# EAGLE design PDM (EAGLE 7.7.0)
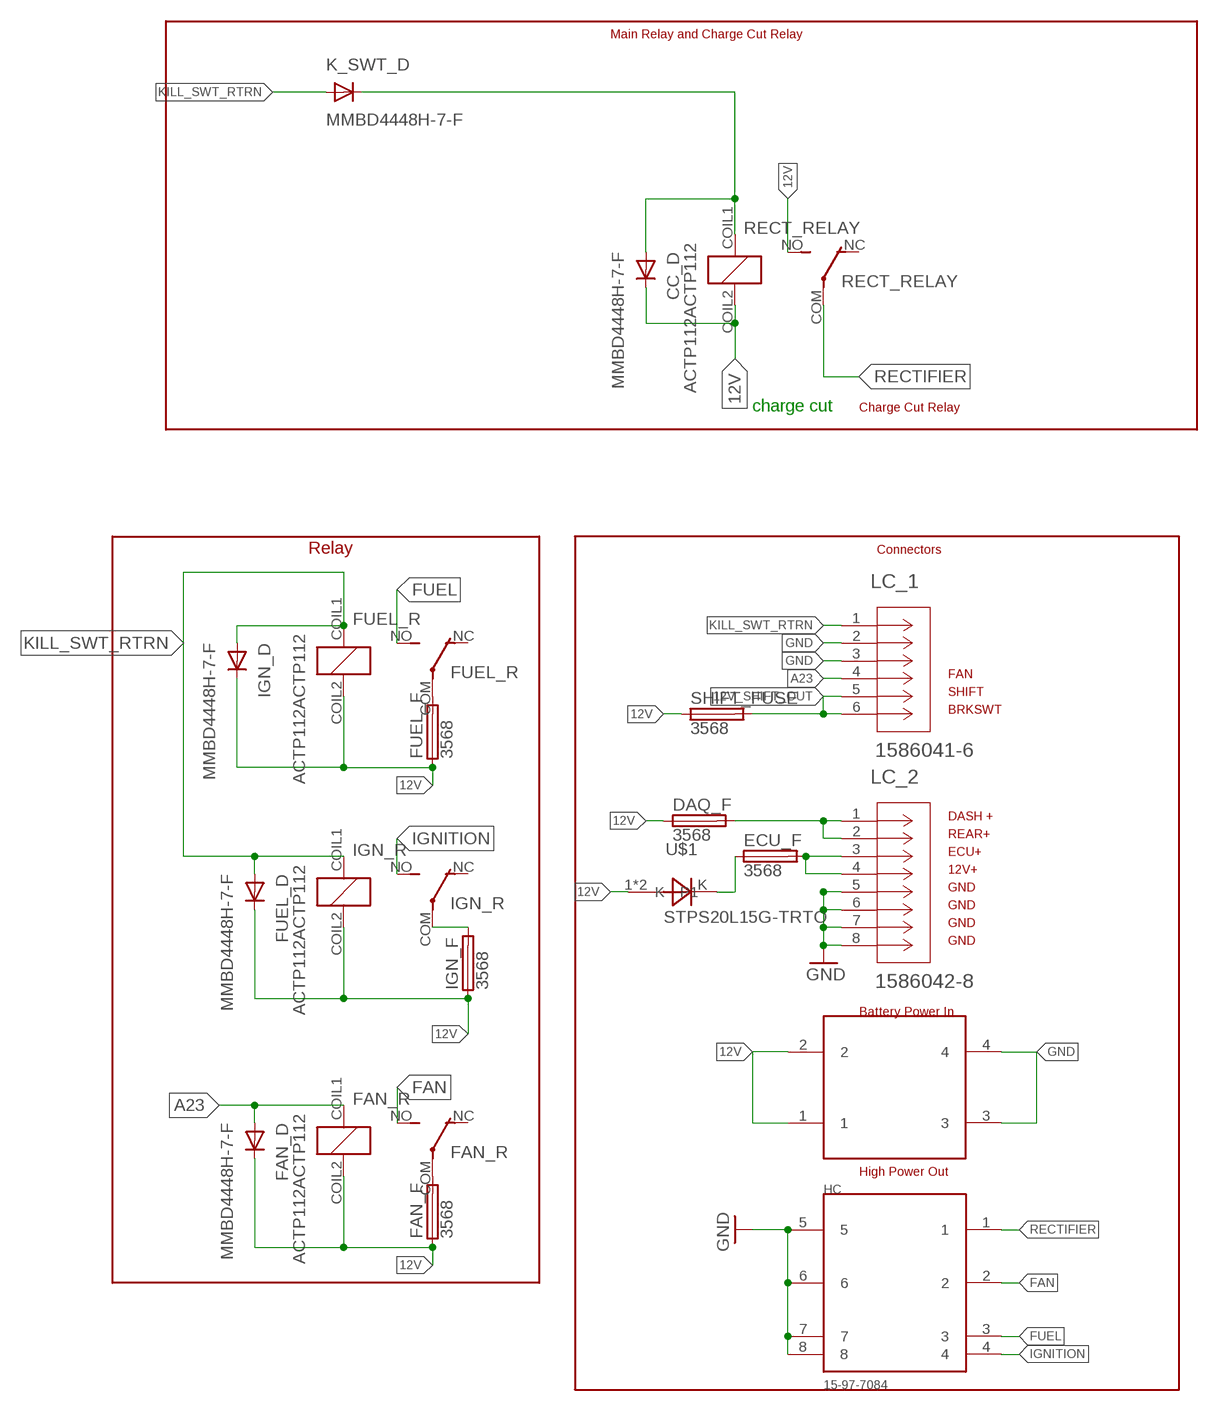
[diagram p0: schematic, sheet 1]

## Parts
BAT_SUP  15-97-8043  [15-97-8043]
CC_D  MMBD4448H-7-F  [SOT23-3]
DAQ_F  3568  [3568]
ECU_F  3568  [3568]
FAN_D  MMBD4448H-7-F  [SOT23-3]
FAN_F  3568  [3568]
FAN_R  ACTP112ACTP112  [ACTP112]
FUEL_D  MMBD4448H-7-F  [SOT23-3]
FUEL_F  3568  [3568]
FUEL_R  ACTP112ACTP112  [ACTP112]
HC  15-97-7084  [15-97-7084]
IGN_D  MMBD4448H-7-F  [SOT23-3]
IGN_F  3568  [3568]
IGN_R  ACTP112ACTP112  [ACTP112]
K_SWT_D  MMBD4448H-7-F  [SOT23-3]
LC_1  1586041-6  [1586041-6]
LC_2  1586042-8  [1586042-8]
RECT_RELAY  ACTP112ACTP112  [ACTP112]
SHIFT_FUSE  3568  [3568]
U$1  STPS20L15G-TRTO  [TO-262DIODE]

## Nets
12V: BAT_SUP.1 BAT_SUP.2 CC_D.3(C) DAQ_F.1 DAQ_F.2 FAN_D.3(C) FAN_F.1 FAN_F.2 FAN_R.COIL2 FUEL_D.3(C) FUEL_F.1 FUEL_F.2 FUEL_R.COIL2 IGN_D.3(C) IGN_F.1 IGN_F.2 IGN_R.COIL2 RECT_RELAY.COIL2 RECT_RELAY.NO SHIFT_FUSE.1 SHIFT_FUSE.2 U$1.1 U$1.2(P1)
12V_DAQ_OUT: DAQ_F.3 DAQ_F.4 LC_2.1 LC_2.2
12V_FUSED_ECU: ECU_F.3 ECU_F.4 LC_2.3 LC_2.4
12V_SHIFT_OUT: LC_1.5 LC_1.6 SHIFT_FUSE.3 SHIFT_FUSE.4
A23: FAN_D.1(A) FAN_R.COIL1 LC_1.4
ECU_PROTECTED: ECU_F.1 ECU_F.2 U$1.K
FAN: FAN_R.NO HC.2
FAN_12V: FAN_F.3 FAN_F.4 FAN_R.COM
FUEL: FUEL_R.NO HC.3
FUEL_12V: FUEL_F.3 FUEL_F.4 FUEL_R.COM
GND: BAT_SUP.3 BAT_SUP.4 HC.5 HC.6 HC.7 HC.8 LC_1.2 LC_1.3 LC_2.5 LC_2.6 LC_2.7 LC_2.8
IGN_12V: IGN_F.3 IGN_F.4 IGN_R.COM
IGNITION: HC.4 IGN_R.NO
KILL_SWITCH_DIODE: CC_D.1(A) K_SWT_D.3(C) RECT_RELAY.COIL1
KILL_SWT_RTRN: FUEL_D.1(A) FUEL_R.COIL1 IGN_D.1(A) IGN_R.COIL1 K_SWT_D.1(A) LC_1.1
RECTIFIER: HC.1 RECT_RELAY.COM
Unconnected: FAN_R.NC FUEL_R.NC IGN_R.NC RECT_RELAY.NC

## Notes on the sheet
- Main Relay and Charge Cut Relay
- charge cut | Charge Cut Relay
- Relay | Connectors
- FAN
- SHIFT
- BRKSWT
- DASH +
- REAR+
- ECU+
- 12V+
- GND
- GND
- GND
- GND
- Battery Power In
- High Power Out

## Library data of the parts
BAT_SUP = molex:15-97-8043
CC_D FAN_D FUEL_D IGN_D K_SWT_D = diodes-inc:MMBD4448H-7-F
DAQ_F ECU_F FAN_F FUEL_F IGN_F SHIFT_FUSE = Keystone:3568: Mini ATC Fuse Holder 20A 500V 1 Circuit Blade PCB
FAN_R FUEL_R IGN_R RECT_RELAY = panasonic:ACTP112: ACTP112 Through-Hole Micro Relay
HC = molex:15-97-7084
LC_1 = BMS Lbr:1586041-6: TE VAL-U-LOK TPA 6 Pin Header
LC_2 = BMS Lbr:1586042-8: 1586042-8 8 pin Val-U-Lock TPA
U$1 = st-microelectronics:STPS20L15G-TR

## Board
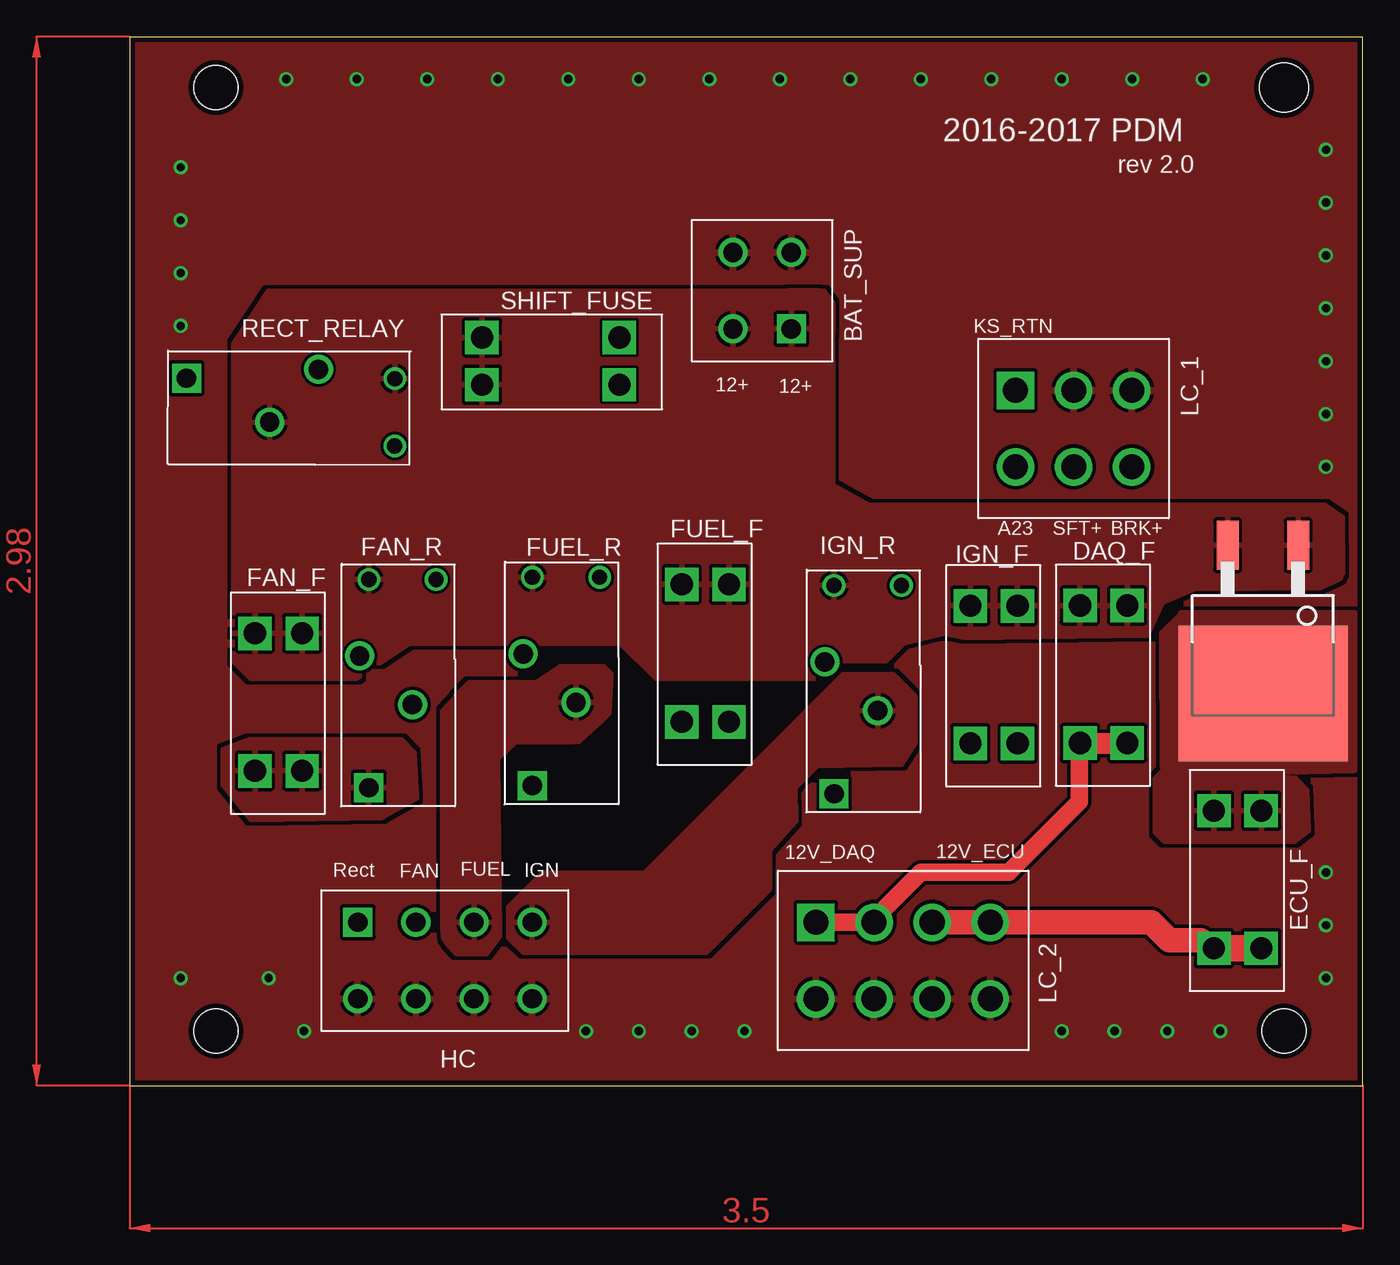
[diagram p1: board, top side]
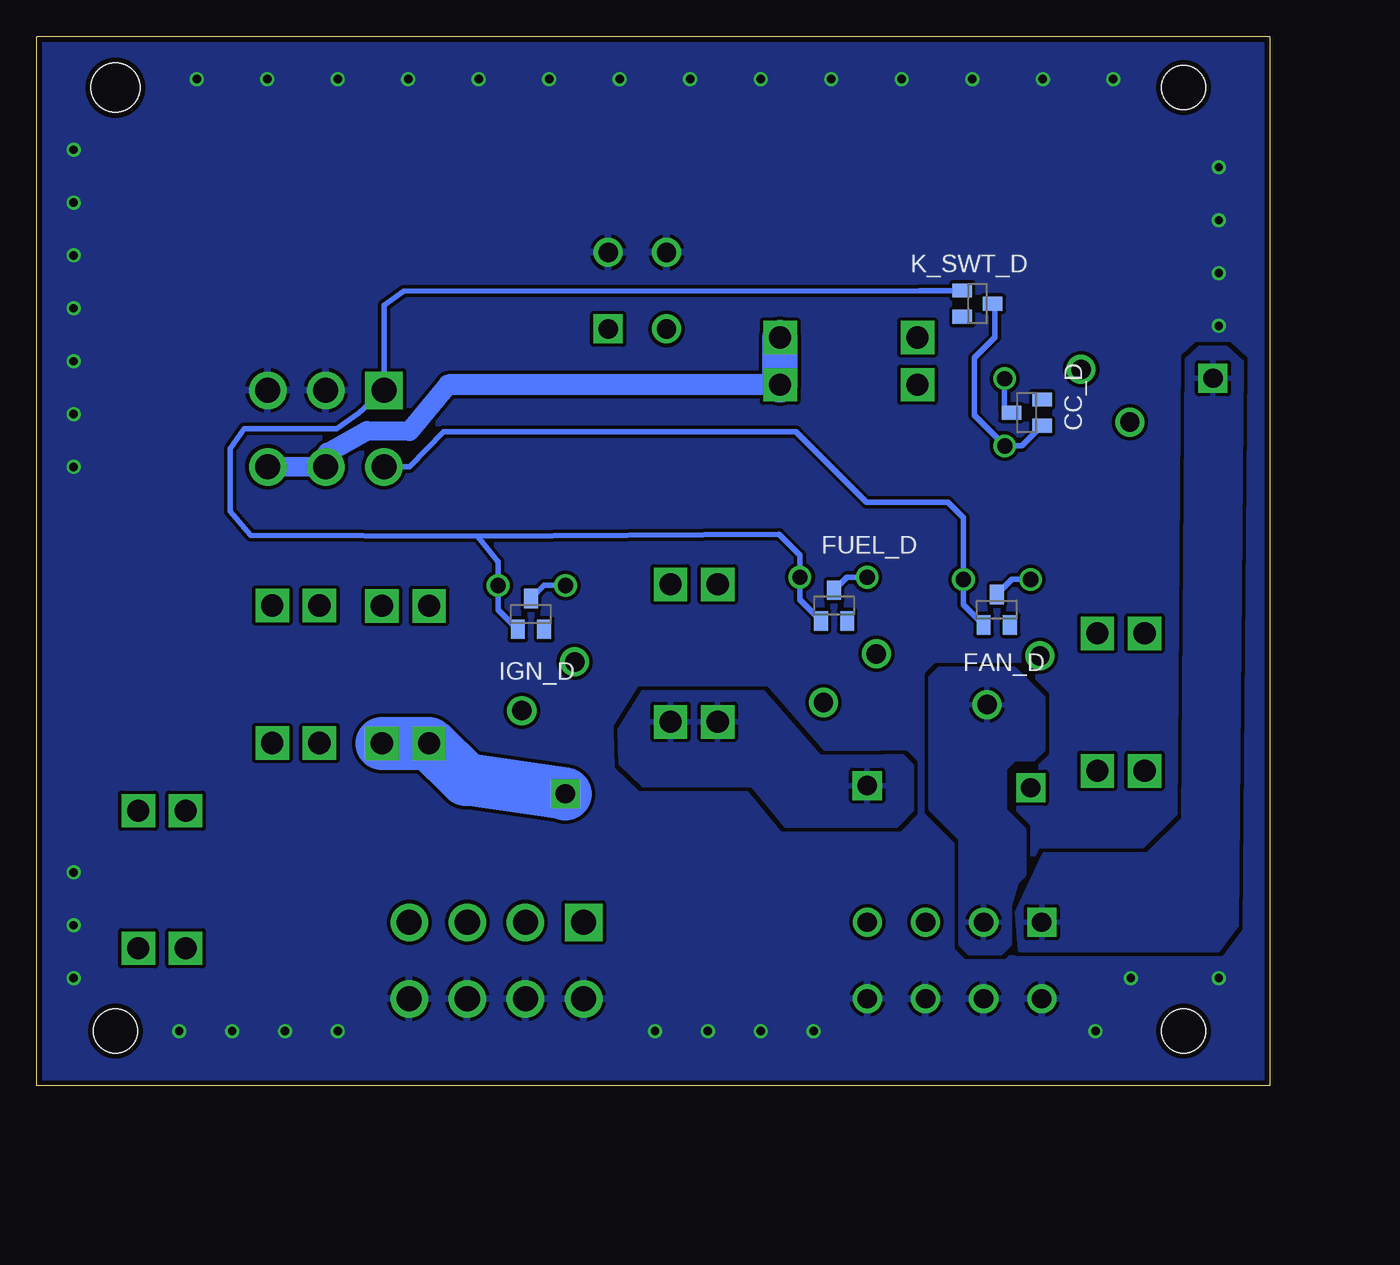
[diagram p2: board, bottom side, seen from below]

Size 88.9 x 75.59 mm. Coordinates in mm from the lower left corner, seen from the top.
Outline: 0,0 88.9,0 88.9,75.59 0,75.59 0,0
Copper layers (1*16): Top 0.035mm / dielectric 1.5mm / Bottom 0.035mm
Design rules "default *": minimum track width 10mil, minimum drill 15mil, track to track 8mil, track to pad 8mil, pad to pad 8mil, via to via 8mil, smd to smd 8mil, copper to edge 15mil, drill to drill 18mil, minimum pad ring 10mil, minimum via ring 8mil, stop-mask expansion 4mil, vias tented up to drill 0mil, thermal gap 10mil
Holes 3.17 mm at 6.22,3.94 83.21,3.94 6.22,71.91
Holes 3.56 mm at 83.21,71.91

### Footprints (pad centres in the part's own frame; a part is rotated, then mirrored left to right if it is on the bottom)
15-97-8043 = drill 1.397 pad 1.803 square: 1 2.101,-2.756 | drill 1.397 pad 1.803: 2 -2.101,-2.756; 4 -2.101,2.756 | drill 1.397 pad 1.829: 3 2.101,2.756
SOT23-3 = smd 1 x 1.4: 1 -0.95,-1.1; 2 0.95,-1.1; 3 0,1.1
3568 = drill 1.6 square: 1 -4.953,1.702; 2 -4.953,-1.702; 3 4.953,1.702; 4 4.953,-1.702
ACTP112 = drill 1.092: COIL1 5.512,-5.512; COIL2 5.512,-0.66 | drill 1.397 square: COM -9.5,-0.66 | drill 1.397: NC 0,0; NO -3.505,-3.81
15-97-7084 = drill 1.397 square: 1 6.287,-2.756 | drill 1.397: 2 2.095,-2.756; 3 -2.095,-2.756; 4 -6.287,-2.756; 5 6.287,2.756; 6 2.095,2.756; 7 -2.095,2.756; 8 -6.287,2.756
1586041-6 = drill 1.803 square: 1 -4.191,2.756 | drill 1.803: 2 0,2.756; 3 4.191,2.756; 4 -4.191,-2.756; 5 0,-2.756; 6 4.191,-2.756
1586042-8 = drill 1.803 square: 1 -6.287,2.756 | drill 1.803: 2 -2.095,2.756; 3 2.095,2.756; 4 6.287,2.756; 5 -6.287,-2.756; 6 -2.095,-2.756; 7 2.095,-2.756; 8 6.287,-2.756
TO-262DIODE = smd 1.6 x 3.5: 1 -2.54,-5.08; 2 2.54,-5.08 | smd 12.2 x 9.75: K 0,5.601

### Placement (x,y rotation side)
BAT_SUP  45.59,57.28 0 top
CC_D  17.53,48.49 90 bottom
DAQ_F  70.21,29.64 270 top
ECU_F  79.86,14.86 270 top
FAN_D  19.68,34.29 0 bottom
FAN_F  10.74,27.64 270 top
FAN_R  16.59,30.96 90 top
FUEL_D  31.42,34.59 0 bottom
FUEL_F  41.5,31.17 270 top
FUEL_R  28.37,31.11 90 top
HC  22.73,9.02 180 top
IGN_D  53.26,33.99 0 bottom
IGN_F  62.31,29.62 270 top
IGN_R  50.11,30.53 90 top
K_SWT_D  21.08,56.34 270 bottom
LC_1  68.05,47.35 0 top
LC_2  55.75,9.02 0 top
RECT_RELAY  13.61,51.61 359.9 top
SHIFT_FUSE  30.35,52.2 0 top
U$1  81.69,33.86 180 top

### Tracks (layer width: path | path; a pad name or v marks a point on that pad's centre or on a via)
12V
  Top 0.406: 42.87,54.52 BAT_SUP.2
  Bottom 0.381: FUEL_D.3 30.49,36.63 FUEL_R.COIL2 | IGN_D.3 52.31,36.04 IGN_R.COIL2 | FAN_D.3 18.6,36.47 FAN_R.COIL2 | CC_D.3 19.12,48.62
  Bottom 0.406: 19.12,48.62 RECT_RELAY.COIL2
  pour Top: 7.49,53.47 10.03,57.28 50.06,57.23 50.7,56.34 50.67,51.89 50.65,51.64 50.65,51.26 50.67,49.66 50.67,43.31 53.34,41.83 86.13,41.81 87.4,40.97 87.43,36.93 87.25,36.55 85.78,35.89 76.73,35.81 74.42,34.82 73.33,32.46 60.3,32.26 58.7,32.61 55.75,31.88 54.48,30.61 50.67,30.61 49.4,29.34 37.97,29.34 35.43,31.88 20.19,31.88 16.38,29.34 8.76,29.34 7.49,30.61
  pour Top: 41.1,57.15 49.56,57.3 40.87,57
12V_DAQ_OUT
  Top 1.27: LC_2.1 LC_2.2 53.66,12 57.02,15.37 63.37,15.37 68.45,20.45 68.45,23.52 DAQ_F.4
  Top 1.524: DAQ_F.4 DAQ_F.3
12V_FUSED_ECU
  Top 1.778: LC_2.3 LC_2.4 73.65,11.77 74.93,10.49 77.22,10.49 ECU_F.4
  Top 1.905: ECU_F.4 ECU_F.3
12V_SHIFT_OUT
  Bottom 1.397: 59.23,50.49 62.03,47.17 65.08,47.19 67.89,45.59 | LC_1.5 LC_1.6
  Bottom 1.524: SHIFT_FUSE.4 59.23,50.49 | 67.89,45.59 67.94,44.69 LC_1.5
  Bottom 2.54: SHIFT_FUSE.4 SHIFT_FUSE.3
A23
  Bottom 0.381: 62,44.58 59.56,47.12 34.16,47.12 29.08,42.04 23.22,42.04
  Bottom 0.406: 62,44.58 63.84,44.58 LC_1.4 | 23.22,42.04 22.1,40.92 FAN_R.COIL1 22.1,34.65 FAN_D.1
ECU_PROTECTED
  pour Top (no thermals): 75.77,34.06 88.27,34.09 89.1,33.25 89.1,23.16 88.24,22.68 74.73,22.4 74.45,23.04 74.4,32.64 75.79,33.99
  pour Top: 74.83,22.91 84.02,22.15 84.86,21.29 84.96,18.36 83.9,17.58 74.63,17.63 73.94,18.31 73.94,22.12 74.7,22.89
FAN
  pour Bottom: 18.8,11.07 18.8,10.21 19.43,9.58 21.62,9.58 22.28,10.24 22.28,17.83 24.43,19.99 24.43,29.36 23.8,30 18.47,30 16.38,27.91 16.38,24.21 17.04,23.55 18.47,23.55 19.13,22.89 19.13,19.81 17.73,18.41 17.73,15.24 18.29,14.68 18.8,13 18.8,11.13 18.72,11.07
FAN_12V
  pour Top: 8.66,24.92 6.73,24.21 6.73,21.67 8.76,19.18 18.16,19.3 20.7,20.7 20.52,24 19.56,24.94
FUEL
  pour Top: 22.63,10.64 22.96,10.16 23.57,9.5 25.7,9.47 26.67,10.77 26.52,23.57 27.79,24.74 31.95,24.79 32.41,24.82 33.76,26.09 34.54,26.87 34.7,29.67 34.14,30.23 31.04,30.2 29.31,29.03 24.51,29.03 23.5,28.02 23.5,27.99 22.58,26.97 22.58,11.46
FUEL_12V
  pour Bottom: 27.79,23.67 32.46,23.67 36.53,28.32 45.16,28.35 46.84,25.65 46.79,23.22 45.14,21.67 37.26,21.64 34.87,18.77 26.92,18.77 25.83,19.86 25.83,23.01 26.52,23.7 27.76,23.7
GND  (via drill 0.6)
  other vias: 11.3,72.52 16.38,72.52 21.46,72.52 26.54,72.52 31.62,72.52 36.7,72.52 41.78,72.52 46.86,72.52 51.94,72.52 57.02,72.52 62.1,72.52 67.18,72.52 72.26,72.52 77.34,72.52 86.23,44.58 86.23,48.39 86.23,52.2 86.23,56.01 86.23,59.82 86.23,15.37 86.23,11.56 74.8,3.94 70.99,3.94 67.18,3.94 44.32,3.94 40.51,3.94 36.7,3.94 32.89,3.94 12.57,3.94 10.03,7.75 3.68,7.75 86.23,7.75 78.61,3.94 3.68,66.17 3.68,62.36 3.68,58.55 3.68,54.74 86.23,63.63 86.23,67.44
  pour Top (isolate 0.254, rank 2): -1.02,76.76 90.17,76.2 91.44,-1.27 -1.27,-1.27
  pour Bottom (isolate 0.254, rank 3): -1.27,77.47 91.44,77.47 90.17,-1.27 -1.27,-1.27
IGN_12V
  Bottom 3.81: IGN_R.COM 57.96,22.07 IGN_F.4 IGN_F.3
IGNITION
  pour Top: 52.4,29.59 55.02,29.59 56.59,28.02 56.59,24.66 55.63,23.16 49.5,23.04 47.96,21.49 48.01,19.05 46.13,16.97 46.13,14.17 41.55,9.6 28.4,9.6 27.33,10.67 27.33,12.83 29.79,15.29 37.13,15.29 51.46,29.62 52.5,29.62
KILL_SWITCH_DIODE
  Bottom 0.381: K_SWT_D.3 19.84,56.19 19.84,53.92 21.32,52.44
  Bottom 0.406: CC_D.1 17.87,46.09 RECT_RELAY.COIL1 21.32,48.29 21.32,52.44
KILL_SWT_RTRN
  Bottom 0.381: 63.83,56.24 62.46,57.23 25.27,57.28 22.8,57.28 K_SWT_D.1 | 55.68,37.8 55.63,37.74 IGN_R.COIL1 55.63,34.3 IGN_D.1
  Bottom 0.406: 57.1,39.6 35.38,39.73 33.88,38.23 FUEL_R.COIL1 33.88,35.01 FUEL_D.1 | 57.1,39.6 73.48,39.67 74.95,41.4 74.95,45.87 73.94,47.32 67.26,47.32 65.67,48.44 LC_1.1 63.83,50.13 63.83,56.24 | 55.68,37.8 57.1,39.6
RECTIFIER
  pour Bottom (isolate 0.254): 3.23,53.16 2.06,52.12 2.41,11.56 3.76,9.8 17.98,9.78 18.21,12.45 16.21,16.69 8.76,16.64 6.22,19.18 5.94,52.3 5.05,53.14
(copper drawn outside any net)
  shapes: Top area x2

### Text on the board
_tsilk: 2016-2017 PDM | rev 2.0 | KS_RTN | 12+ | 12+ | A23 | SFT+ | BRK+ | 12V_DAQ | 12V_ECU | Rect | FAN | FUEL | IGN | LC_2